# Altium schematic sheet power_core.SchDoc: Core power conversion
size A4; SheetNumber: 7; SheetTotal: 11
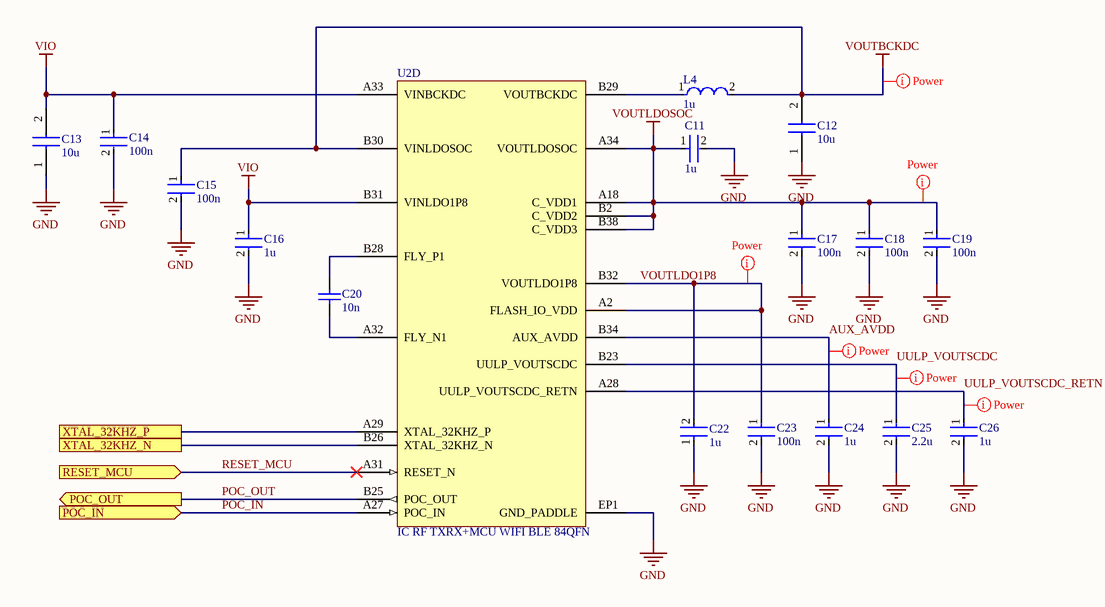
[diagram p0: power_core.SchDoc]

## Parts
C11  1u  [FP-GRM155-0_05-MFG]
C12  10u  [CAPC1608X100N]
C13  10u  [CAPC1608X100N]
C14  100n  [FP-GRT155-0_05-MFG]
C15  100n  [FP-GRT155-0_05-MFG]
C16  1u  [FP-GRM155-0_05-MFG]
C17  100n  [FP-GRT155-0_05-MFG]
C18  100n  [FP-GRT155-0_05-MFG]
C19  100n  [FP-GRT155-0_05-MFG]
C20  10n  [CAPC1005X55X25LL05T10]
C22  1u  [FP-GRM155-0_05-MFG]
C23  100n  [FP-GRT155-0_05-MFG]
C24  1u  [FP-GRM155-0_05-MFG]
C25  2.2u  [FP-GRM155-0_2-IPC_C]
C26  1u  [FP-GRM155-0_05-MFG]
L4  1u  [FP-DFE201210U-IPC_C]
U2  IC RF TXRX+MCU WIFI BLE 84QFN  [SIWG917M110LGTBA]  (part D of 4)

## Ports
POC_IN (in, see power_io[3B], debug_interface[3B], power_io[2B]), POC_OUT (out, see power_io[3B], debug_interface[3A], power_io[2B]), RESET_MCU (in, see power_io[3B], debug_interface[1C], power_io[2B]), XTAL_32KHZ_N (see power_io[3B], power_io[2B], rf_clocks[2B]), XTAL_32KHZ_P (see power_io[3B], power_io[2B], rf_clocks[1B])

## Nets
GND: C11.2 C12.1 C13.1 C14.2 C15.2 C16.2 C17.2 C18.2 C19.2 C22.1 C23.2 C24.2 C25.2 C26.2 U2.EP1(GND_PADDLE)
VIO: C13.2 C14.1 C16.1 U2.A33(VINBCKDC) U2.B31(VINLDO1P8)
VOUTBCKDC: C12.2 C15.1 L4.2 U2.B30(VINLDOSOC)
VOUTLDOSOC: C11.1 C17.1 C18.1 C19.1 U2.A18(C_VDD1) U2.A34(VOUTLDOSOC) U2.B2(C_VDD2) U2.B38(C_VDD3)
AUX_AVDD: C24.1 U2.B34(AUX_AVDD)
POC_IN: U2.A27(POC_IN) ; port POC_IN
POC_OUT: U2.B25(POC_OUT) ; port POC_OUT
RESET_MCU: U2.A31(RESET_N) ; port RESET_MCU
UULP_VOUTSCDC: C25.1 U2.B23(UULP_VOUTSCDC)
UULP_VOUTSCDC_RETN: C26.1 U2.A28(UULP_VOUTSCDC_RETN)
VOUTLDO1P8: C22.2 C23.1 U2.A2(FLASH_IO_VDD) U2.B32(VOUTLDO1P8)
XTAL_32KHZ_N: U2.B26(XTAL_32KHZ_N) ; port XTAL_32KHZ_N
XTAL_32KHZ_P: U2.A29(XTAL_32KHZ_P) ; port XTAL_32KHZ_P
NetC20_1: C20.1 U2.B28(FLY_P1)
NetC20_2: C20.2 U2.A32(FLY_N1)
NetL4_1: L4.1 U2.B29(VOUTBCKDC)

## Layout directives
net class Power: AUX_AVDD, UULP_VOUTSCDC, UULP_VOUTSCDC_RETN, VOUTBCKDC, VOUTLDO1P8, VOUTLDOSOC

## Notes on the sheet
- Project:
- Laboratory:
- Date:
- File:
- Rev:
- Variation:
- Drawn By:
- Checked By:
- Sheet:
- /

## Library data of the parts
C11 C16 C22 C24 C26 = CMP-06035-025126-1: Chip Multilayer Ceramic Capacitors for General Purpose, 0402, 1.0uF, X6S, 22%, 10%, 16V; Capacitance: 1uF; Thickness: 500um; Voltage Rating (DC): 16V; Tolerance: 10%; Width: 500um; Length: 1mm; Dielectric: X6S
C12 C13 = GMC10X7R106K10NT: Cap Cer 10UF 10V X7R 0603; Manufacturer_Name: Cal-Chip; Datasheet Link: https://88ce57.p3cdn1.secureserver.net/wp-content/uploads/2023/01/gmc_series-2.pdf; Height: 1mm; Manufacturer_Part_Number: GMC10X7R106K10NT; Supplier 1: Digikey; Supplier Part Number 1: 4713-GMC10X7R106K10NTCT-ND
C14 C15 C17-C19 C23 = CMP-06035-014200-1: Multi-Layer Ceramic Capacitor 100nF 50V X7R ±10% 0402 Paper T/R
C20 = CMP-1034-01880-2: Manufacturer: Murata; Part Number: GRM155R71E103KA01D
C25 = CMP-06035-000377-1: Chip Multilayer Ceramic Capacitors for General Purpose, 0402, 2.2uF, X7S, 22%, 10%, 10V; Thickness: 0.022inch; Height: 0.5mm; Packaging: Tape and Reel; Voltage Rating (DC): 10V; Tolerance: 10%; Capacitance: 2.2uF; Case Code (Metric): 1005; Voltage Rating: 10V; Termination: SMD/SMT; Weight: 0.000212oz; Min Operating Temperature: -55°C; Max Operating Temperature: 125°C; Case/Package: 0402; Length: 0.039inch; Dielectric: X7S; Resistor Type: Ceramic; Width: 0.5mm; Mount: Surface Mount; Package Quantity: 10000; Case Code (Imperial): 0402; Lead Free: Lead Free
L4 = CMP-06042-016601-1: FIXED IND 1.0UH 2.0A 95MOHM; RoHS Compliant: Yes
U2 = SIWG917